# Altium schematic sheet 03 Meter&Pwm&KEY.SchDoc: Title
size A3; ApprovedBy: Approve; CheckedBy: Check; DrawnBy: 叶天宝; Organization: HNS; DocumentNumber: 3; SheetNumber: 3; SheetTotal: 5
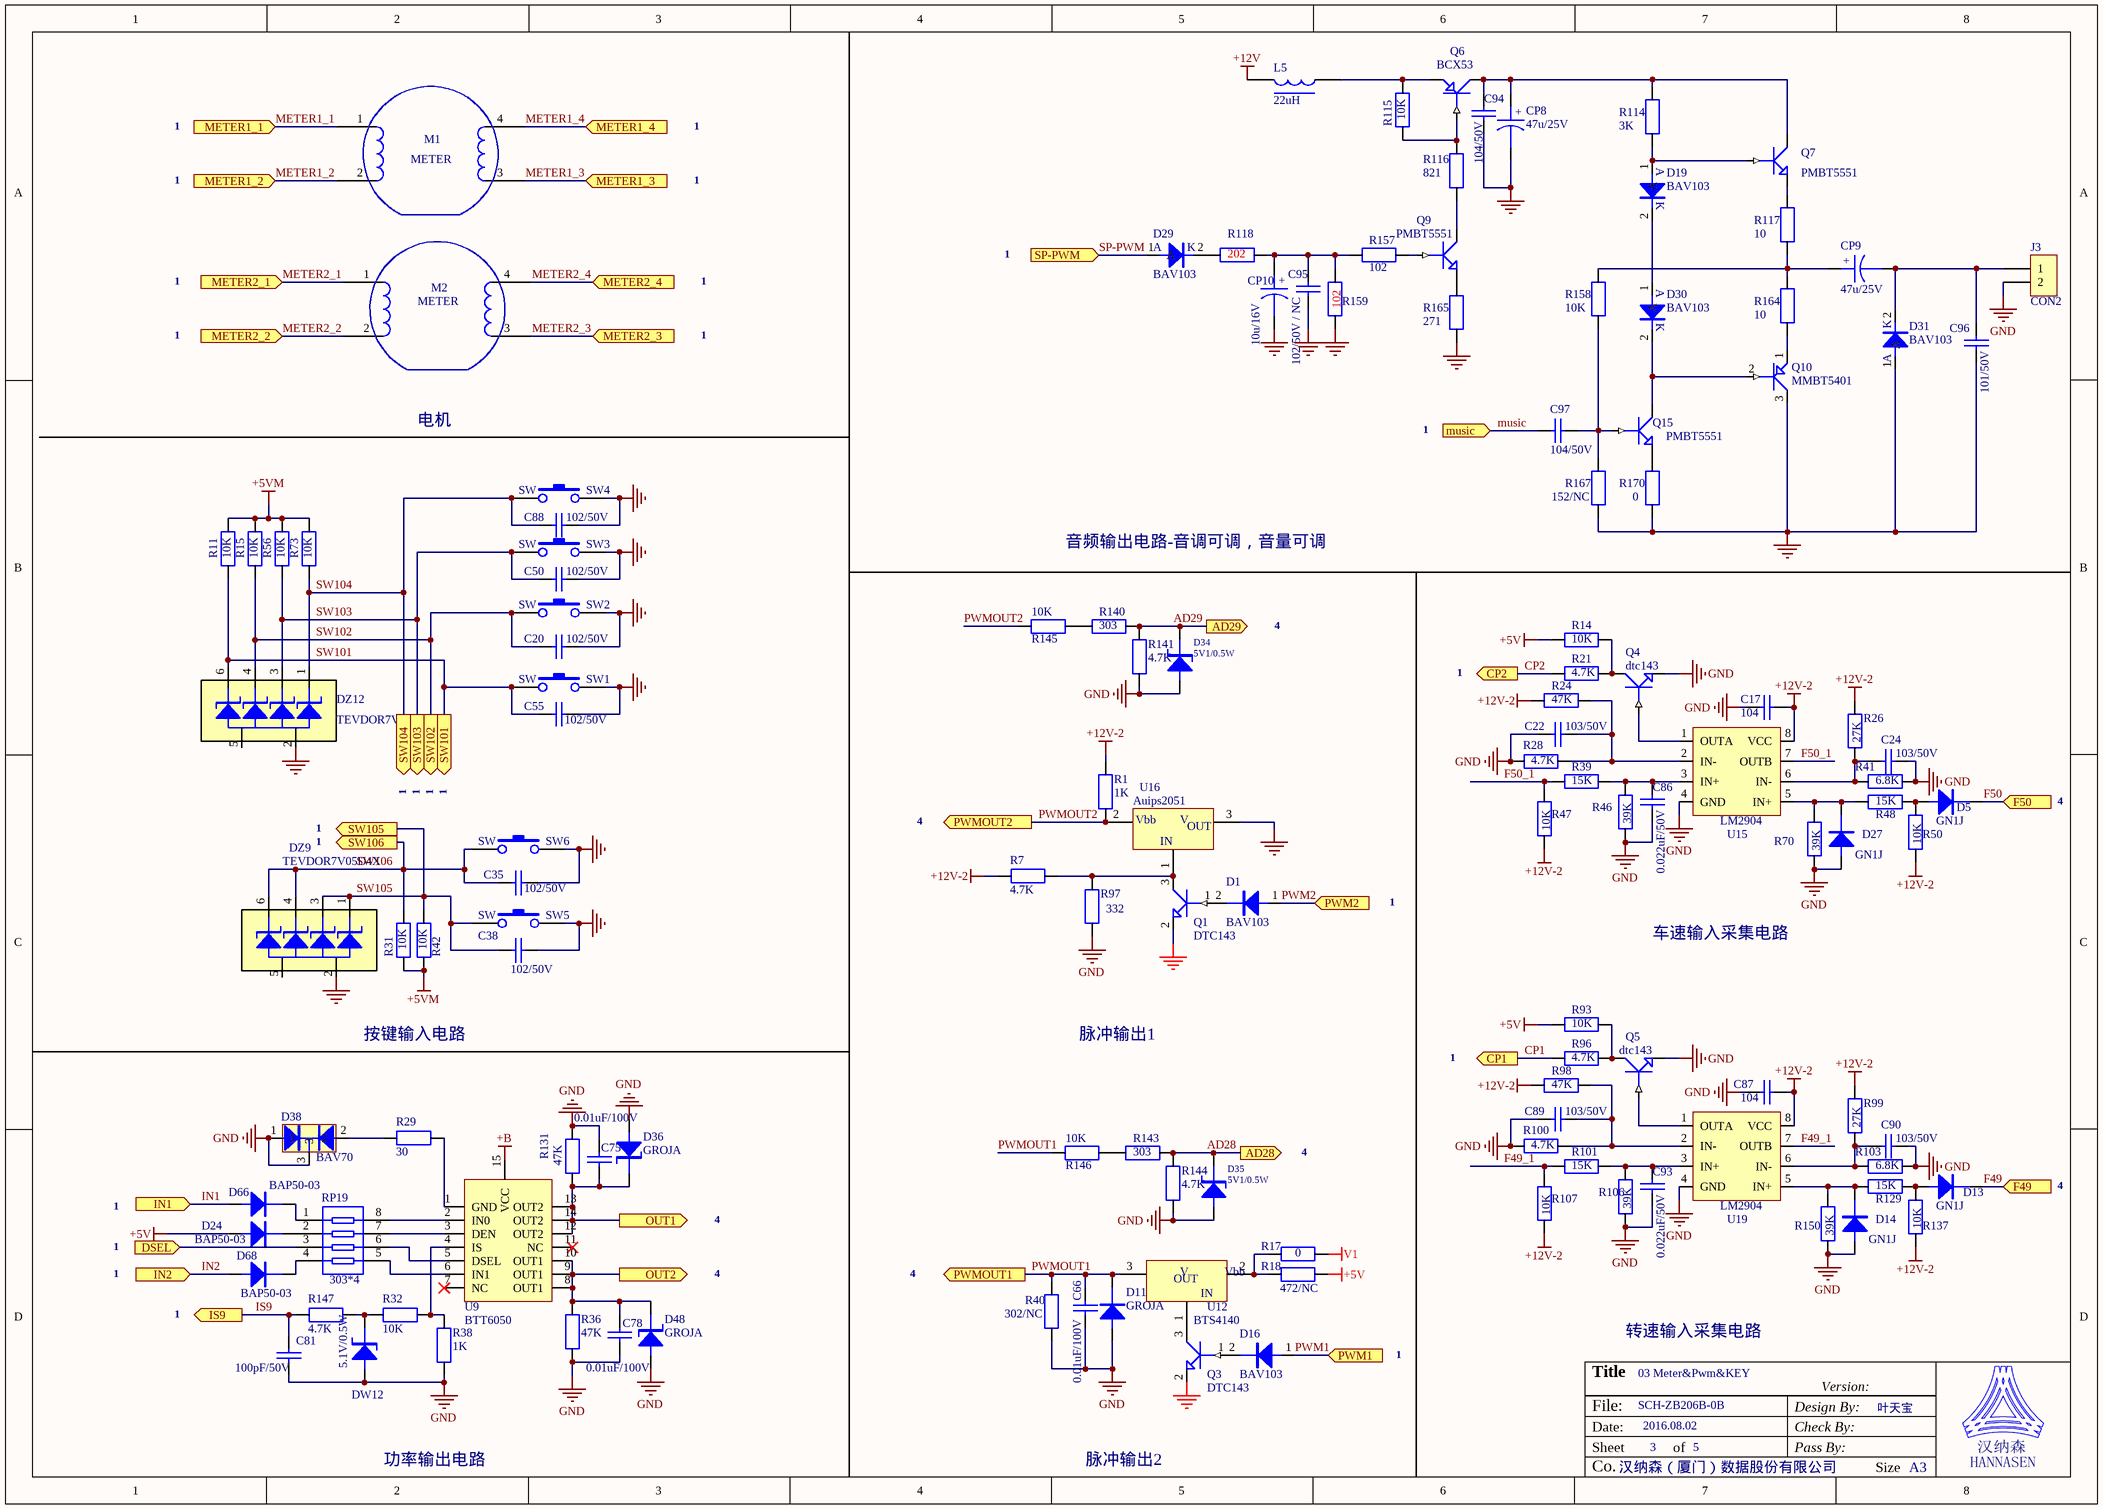
[diagram p0: 03 Meter&Pwm&KEY.SchDoc]

## Parts
C17  104  [CR0805]
C20  102/50V  [CR0805]
C22  103/50V  [CR0805]
C24  103/50V  [CR0805]
C35  102/50V  [CR0805]
C38  102/50V  [CR0805]
C50  102/50V  [CR0805]
C55  102/50V  [CR0805]
C66  0.01uF/100V  [CR0805]
C75  0.01uF/100V  [CR0805]
C78  0.01uF/100V  [CR0805]
C81  100pF/50V  [CR0805]
C86  0.022uF/50V  [CR0805]
C87  104  [CR0805]
C88  102/50V  [CR0805]
C89  103/50V  [CR0805]
C90  103/50V  [CR0805]
C93  0.022uF/50V  [CR0805]
C94  104/50V  [CR0805]
C95  102/50V / NC  [CR0805]
C96  101/50V  [CR0805]
C97  104/50V  [CR0805]
CP8  47u/25V  [10uF/25V]
CP9  47u/25V  [10uF/25V]
CP10  10u/16V  [CE1206]
D1  BAV103  [SOD-80C]
D5  GN1J  [SMA]
D11  GROJA  [SMA]
D13  GN1J  [SMA]
D14  GN1J  [SMA]
D16  BAV103  [SOD-80C]
D19  BAV103  [SOD-80C]
D24  BAP50-03  [SOD323]
D27  GN1J  [SMA]
D29  BAV103  [SOD-80C]
D30  BAV103  [SOD-80C]
D31  BAV103  [SOD-80C]
D34  5V1/0.5W  [SOD-80C]
D35  5V1/0.5W  [SOD-80C]
D36  GROJA  [SMA]
D38  BAV70  [SOT23]
D48  GROJA  [SMA]
D66  BAP50-03  [SOD323]
D68  BAP50-03  [SOD323]
DW12  5.1V/0.5W  [SOD-80C]
DZ9  TEVDOR7V05D4X  [SOT-457]
DZ12  TEVDOR7V05D4X  [SOT-457]
J3  CON2  [DIP 1X2 2.5mm]
L5  22uH  [Ind-Q07-3-022]
M1  METER  [METER2]
M2  METER  [METER2]
Q1  DTC143  [SOT23]
Q3  DTC143  [SOT23]
Q4  dtc143  [SOT-23]
Q5  dtc143  [SOT-23]
Q6  BCX53  [SOT89]
Q7  PMBT5551  [SMT3]
Q9  PMBT5551  [SMT3]
Q10  MMBT5401  [SMT3]
Q15  PMBT5551  [SMT3]
R1  1K  [CR1206]
R7  4.7K  [CR0805]
R11  10K  [CR0805]
R14  10K  [CR0805]
R15  10K  [CR0805]
R17  0  [CR1206]
R18  472/NC  [CR1206]
R21  4.7K  [CR0805]
R24  47K  [CR0805]
R26  27K  [CR0805]
R28  4.7K  [CR0805]
R29  30  [CR0805]
R31  10K  [CR0805]
R32  10K  [CR0805]
R36  47K  [CR0805]
R38  1K  [CR0805]
R39  15K  [CR0805]
R40  302/NC  [CR0805]
R41  6.8K  [CR0805]
R42  10K  [CR0805]
R46  39K  [CR0805]
R47  10K  [CR0805]
R48  15K  [CR0805]
R50  10K  [CR0805]
R56  10K  [CR0805]
R70  39K  [CR0805]
R73  10K  [CR0805]
R93  10K  [CR0805]
R96  4.7K  [CR0805]
R97  332  [CR0805]
R98  47K  [CR0805]
R99  27K  [CR0805]
R100  4.7K  [CR0805]
R101  15K  [CR0805]
R103  6.8K  [CR0805]
R106  39K  [CR0805]
R107  10K  [CR0805]
R114  3K  [CR0805]
R115  10K  [CR0805]
R116  821  [CR0805]
R117  10  [CR0805]
R118  202  [CR0805]
R129  15K  [CR0805]
R131  47K  [CR0805]
R137  10K  [CR0805]
R140  303  [CR0805]
R141  4.7K  [CR0805]
R143  303  [CR0805]
R144  4.7K  [CR0805]
R145  10K  [CR1206]
R146  10K  [CR1206]
R147  4.7K  [CR0805]
R150  39K  [CR0805]
R157  102  [CR0805]
R158  10K  [CR0805]
R159  102  [CR0805]
R164  10  [CR0805]
R165  271  [CR0805]
R167  152/NC  [CR0805]
R170  0  [CR0805]
RP19  303*4  [R4]
SW1  SW  [Switch-1]
SW2  SW  [Switch-1]
SW3  SW  [Switch-1]
SW4  SW  [Switch-1]
SW5  SW  [Switch-1]
SW6  SW  [Switch-1]
U9  BTT6050  [PG-DSO-14 -40]
U12  BTS4140  [SOT-223]
U15  LM2904  [SO-8]
U16  Auips2051  [SOT-223]
U19  LM2904  [SO-8]

## Ports
AD28 (out), AD29 (out), CP1 (out), CP2 (out), DSEL (in), F49 (in), F50 (in), IN1 (in), IN2 (in), IS9 (out), METER1_1 (in), METER1_2 (in), METER1_3 (in), METER1_4 (in), METER2_1 (in), METER2_2 (in), METER2_3 (in), METER2_4 (in), music (in), OUT1 (out), OUT2 (out), PWM1 (in), PWM2 (in), PWMOUT1 (out), PWMOUT2 (out), SP-PWM (in), SW101 (out), SW102 (out), SW103 (out), SW104 (out), SW105 (out), SW106 (out)

## Nets
+5V: D24.1(A) R14.2 R18.2 R93.2
+5VM: R11.1 R15.1 R31.2 R42.2 R56.1 R73.1
+12V: L5.2
+12V-2: C17.2 C87.2 R1.2 R7.1 R24.1 R26.2 R47.1 R50.1 R98.1 R99.2 R107.1 R137.1 U15.8(VCC) U19.8(VCC)
+B: U9.15(VCC)
GND: C17.1 C20.1 C22.2 C24.2 C35.1 C38.2 C50.1 C55.1 C66.2 C75.1 C78.2 C81.2 C86.1 C87.1 C88.1 C89.2 C90.2 C93.1 C94.1 C95.1 C96.1 CP8.2 CP10.2 D11.1(A) D14.1(A) D27.1(A) D31.1(A) D34.2(K) D35.2(K) D36.1(A) D38.1 D38.3 D48.1(A) DW12.1(A) DZ9.2 DZ12.2 J3.2 Q1.2(gnd) Q3.2(gnd) Q4.3(E) Q5.3(E) Q10.3 R28.2 R36.1 R38.1 R40.1 R41.2 R46.1 R70.1 R97.1 R100.2 R103.2 R106.1 R131.2 R141.1 R144.1 R150.1 R159.2 R165.1 R167.1 R170.1 SW1.2 SW2.2 SW3.2 SW4.2 SW5.2 SW6.2 U15.4(GND) U16.3(VOUT) U19.4(GND)
V1: R17.2
AD28: D35.1(A) R143.2 R144.2 ; port AD28
AD29: D34.1(A) R140.2 R141.2 ; port AD29
CP1: R96.2 ; port CP1
CP2: R21.2 ; port CP2
DSEL: RP19.3 ; port DSEL
F49: D13.2(K) ; port F49
F49_1: R101.1 R107.2 U19.7(OUTB)
F50: D5.2(K) ; port F50
F50_1: R39.1 R47.2 U15.7(OUTB)
IN1: D66.1(A) ; port IN1
IN2: D68.1(A) ; port IN2
IS9: C81.1 R147.2 ; port IS9
METER1_1: M1.1 ; port METER1_1
METER1_2: M1.2 ; port METER1_2
METER1_3: M1.3 ; port METER1_3
METER1_4: M1.4 ; port METER1_4
METER2_1: M2.1 ; port METER2_1
METER2_2: M2.2 ; port METER2_2
METER2_3: M2.3 ; port METER2_3
METER2_4: M2.4 ; port METER2_4
music: C97.2 ; port music
OUT1: C75.2 D36.2(K) R131.1 U9.12(OUT2) U9.13(OUT2) U9.14(OUT2) ; port OUT1
OUT2: C78.1 D48.2(K) R36.2 U9.8(OUT1) U9.9(OUT1) U9.10(OUT1) ; port OUT2
PWM1: D16.1(A) ; port PWM1
PWM2: D1.1(A) ; port PWM2
PWMOUT1: C66.1 D11.2(K) R40.2 R146.1 U12.3(VOUT) ; port PWMOUT1
PWMOUT2: R1.1 R145.1 U16.2(Vbb) ; port PWMOUT2
SP-PWM: D29.1(A) ; port SP-PWM
SW101: C55.2 DZ12.6 R11.2 SW1.1 ; port SW101
SW102: C20.2 DZ12.4 R15.2 SW2.1 ; port SW102
SW103: C50.2 DZ12.3 R56.2 SW3.1 ; port SW103
SW104: C88.2 DZ12.1 R73.2 SW4.1 ; port SW104
SW105: C38.1 DZ9.1 DZ9.3 R42.1 SW5.1 ; port SW105
SW106: C35.2 DZ9.4 DZ9.6 R31.1 SW6.1 ; port SW106
NetC22_1: C22.1 R24.2 R28.1 U15.2(IN-)
NetC24_1: C24.1 R26.1 R41.1 U15.6(IN-)
NetC86_2: C86.2 R39.2 R46.2 U15.3(IN+)
NetC89_1: C89.1 R98.2 R100.1 U19.2(IN-)
NetC90_1: C90.1 R99.1 R103.1 U19.6(IN-)
NetC93_2: C93.2 R101.2 R106.2 U19.3(IN+)
NetC94_2: C94.2 CP8.1 Q6.2(C) Q7.3(C) R114.2
NetC95_2: C95.2 CP10.1 R118.1 R157.1 R159.1
NetC96_2: C96.2 CP9.2 D31.2(K) J3.1
NetC97_1: C97.1 Q15.2(B) R158.1 R167.2
NetCP9_1: CP9.1 R117.1 R158.2 R164.2
NetD1_2: D1.2(K) Q1.1(in)
NetD5_1: D5.1(A) R48.2 R50.2
NetD13_1: D13.1(A) R129.2 R137.2
NetD14_2: D14.2(K) R129.1 R150.2 U19.5(IN+)
NetD16_2: D16.2(K) Q3.1(in)
NetD19_1: D19.1(A) Q7.2(B) R114.1
NetD19_2: D19.2(K) D30.1(A)
NetD24_2: D24.2(K) RP19.2
NetD27_2: D27.2(K) R48.1 R70.2 U15.5(IN+)
NetD29_2: D29.2(K) R118.2
NetD30_2: D30.2(K) Q10.2(B) Q15.3(C)
NetD38_2: D38.2 R29.2
NetD66_2: D66.2(K) RP19.1
NetD68_2: D68.2(K) RP19.4
NetDW12_2: DW12.2(K) R32.2 R147.1
NetL5_1: L5.1 Q6.3(E) R115.1
NetQ1_3: Q1.3(out) R7.2 R97.2 U16.1(IN)
NetQ3_3: Q3.3(out) U12.1(IN)
NetQ4_1: Q4.1(B) U15.1(OUTA)
NetQ4_2: Q4.2(C) R14.1 R21.1
NetQ5_1: Q5.1(B) U19.1(OUTA)
NetQ5_2: Q5.2(C) R93.1 R96.1
NetQ6_1: Q6.1(B) R115.2 R116.2
NetQ7_1: Q7.1(E) R117.2
NetQ9_1: Q9.1(E) R165.2
NetQ9_2: Q9.2(B) R157.2
NetQ9_3: Q9.3(C) R116.1
NetQ10_1: Q10.1(C) R164.1
NetQ15_1: Q15.1(E) R170.2
NetR17_1: R17.1 R18.1 U12.2(Vbb) U12.4(Vbb)
NetR29_1: R29.1 U9.1(GND)
NetR32_1: R32.1 R38.2 U9.4(IS)
NetR140_1: R140.1 R145.2
NetR143_1: R143.1 R146.2
NetRP19_5: RP19.5 U9.6(IN1)
NetRP19_6: RP19.6 U9.5(DSEL)
NetRP19_7: RP19.7 U9.3(DEN)
NetRP19_8: RP19.8 U9.2(IN0)

Not connected (* = marked no-connect by the designer): DZ9 5; DZ12 5; U9 7(NC)* 11(NC)*; U16 4(Vbb)

## Notes on the sheet
- 1
- 电机
- 音频输出电路-音调可调，音量可调
- 4
- 车速输入采集电路
- 按键输入电路
- 脉冲输出1
- 转速输入采集电路
- 03 Meter&Pwm&KEY
- SCH-ZB206B-0B
- 2016.08.02
- 3
- 5
- 叶天宝
- 功率输出电路
- 脉冲输出2
- Title
- Version:
- File:
- Date:
- Sheet
- of
- Design By:
- Check By:
- Pass By:
- Co.
- 汉纳森（厦门）数据股份有限公司
- Size
- A3
- (in symbol BTS4140) V; OUT
- (in symbol CAPACITOR POL) +

## Library data of the parts
C17 C22 C24 C75 C78 C81 C87 C89 C90 C94-C97 = CAP: 贴片电容
C20 C35 C38 C50 C55 C66 C86 C88 C93 = CAP: Capacitor
CP8-CP10 = CAPACITOR POL: Capacitor
D1 D5 D11 D13 D14 D16 D24 D27 D66 D68 = DIODE: 二极管
D19 D29-D31 = GN1J: 二极管
D34-D36 D48 DW12 = DW: 稳压二极管
D38 = BAV70: TVS; HelpURL: G:\资料\规格书\二三极管\BAV70.pdf
DZ9 DZ12 = BZA456G: 二极管排
J3 = CON2: 连接器-2PIN
L5 = L: 电感
Q1 Q3 Q7 Q9 Q15 = DTC143: NPN; HelpURL: G:\资料\规格书\二三极管\dtc143ee.pdf
Q4 Q5 = NPN1: 贴片三极管
Q6 = PNP1: 贴片三极管
Q10 = DTB143EK: 三极管-PNP带阻
R1 R7 R11 R14 R15 R17 R18 R21 R24 R26 R28 R29 R31 R32 R36 R38-R42 R46-R48 R50 R56 R70 R73 R93 R96-R101 R103 R106 R107 R114-R118 R129 R131 R137 R140 R141 R143-R147 R150 R157-R159 R164 R165 R167 R170 = RES: 贴片电阻
RP19 = R_LINE4: 排阻
SW1-SW6 = SW-PB
U9 = BTT6050: IC; HelpURL: G:\资料\规格书\数字逻辑\74HC595.pdf
U12 U16 = BTS4140: IC-单通道功率开关
U15 U19 = LM2904: IC-双路运放